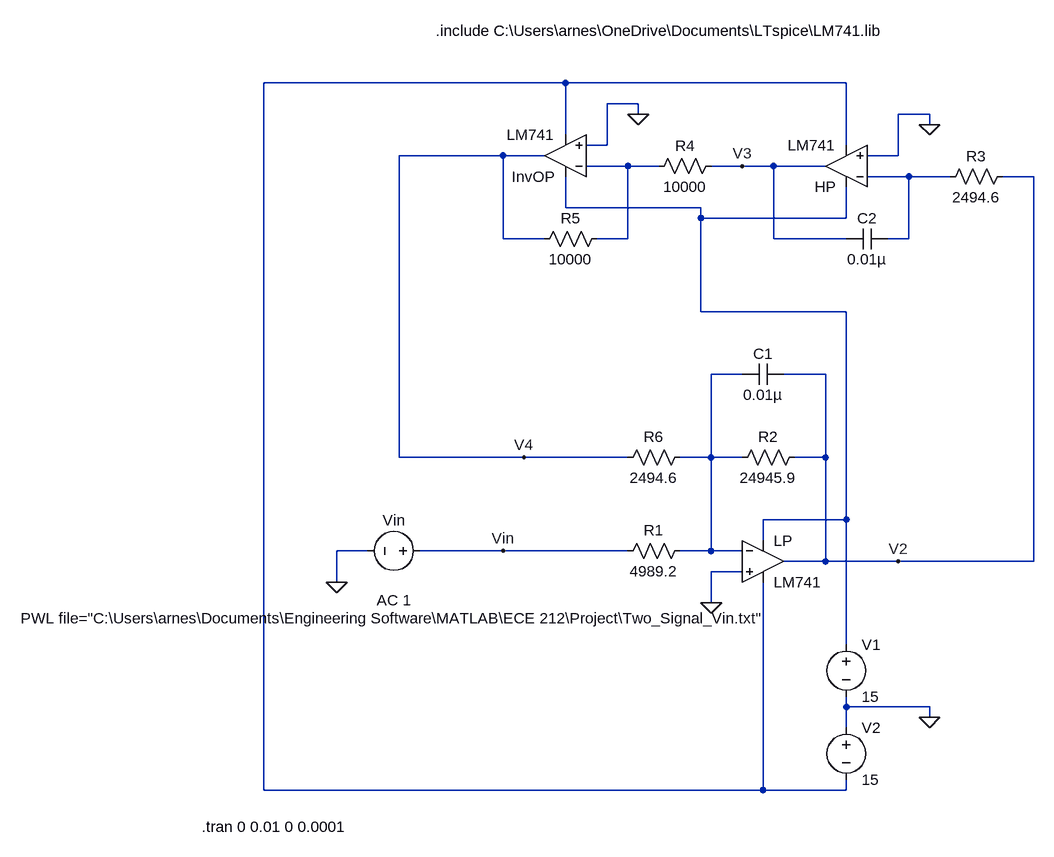
[diagram p0: schematic Band_6380Hz.asc]
Band_6380Hz.asc, the LTspice schematic file:
Version 4.1
SHEET 1 964 792
WIRE 240 -368 -224 -368
WIRE 672 -368 240 -368
WIRE 352 -336 304 -336
WIRE 352 -320 352 -336
WIRE 800 -320 752 -320
WIRE 800 -304 800 -320
WIRE 240 -288 240 -368
WIRE 304 -272 304 -336
WIRE 304 -272 272 -272
WIRE 672 -272 672 -368
WIRE 144 -256 -16 -256
WIRE 208 -256 144 -256
WIRE 752 -256 752 -320
WIRE 752 -256 704 -256
WIRE 336 -240 272 -240
WIRE 384 -240 336 -240
WIRE 512 -240 464 -240
WIRE 560 -240 512 -240
WIRE 640 -240 560 -240
WIRE 768 -224 704 -224
WIRE 832 -224 768 -224
WIRE 960 -224 912 -224
WIRE 240 -176 240 -224
WIRE 448 -176 240 -176
WIRE 448 -160 448 -176
WIRE 672 -160 672 -208
WIRE 672 -160 448 -160
WIRE 144 -128 144 -256
WIRE 208 -128 144 -128
WIRE 336 -128 336 -240
WIRE 336 -128 288 -128
WIRE 560 -128 560 -240
WIRE 672 -128 560 -128
WIRE 768 -128 768 -224
WIRE 768 -128 736 -128
WIRE 448 -16 448 -160
WIRE 672 -16 448 -16
WIRE 512 80 464 80
WIRE 640 80 576 80
WIRE -16 208 -16 -256
WIRE 176 208 -16 208
WIRE 336 208 176 208
WIRE 464 208 464 80
WIRE 464 208 416 208
WIRE 512 208 464 208
WIRE 640 208 640 80
WIRE 640 208 592 208
WIRE 672 304 672 -16
WIRE 672 304 544 304
WIRE 544 336 544 304
WIRE -64 352 -112 352
WIRE 144 352 16 352
WIRE 336 352 144 352
WIRE 464 352 464 208
WIRE 464 352 416 352
WIRE 512 352 464 352
WIRE 640 368 640 208
WIRE 640 368 576 368
WIRE 752 368 640 368
WIRE 960 368 960 -224
WIRE 960 368 752 368
WIRE 512 384 464 384
WIRE -112 400 -112 352
WIRE 464 432 464 384
WIRE 672 496 672 304
WIRE 672 592 672 576
WIRE 800 592 672 592
WIRE 800 608 800 592
WIRE 672 624 672 592
WIRE -224 720 -224 -368
WIRE 544 720 544 400
WIRE 544 720 -224 720
WIRE 672 720 672 704
WIRE 672 720 544 720
FLAG -112 400 0
FLAG 464 432 0
FLAG 800 -304 0
FLAG 352 -320 0
FLAG 176 208 V4
FLAG 144 352 Vin
FLAG 752 368 V2
FLAG 512 -240 V3
FLAG 800 608 0
SYMBOL voltage 32 352 R90
WINDOW 0 -32 56 VBottom 2
WINDOW 3 88 56 VTop 2
WINDOW 123 60 56 VTop 2
WINDOW 39 0 0 Left 0
SYMATTR InstName Vin
SYMATTR Value PWL file="C:\Users\arnes\Documents\Engineering Software\MATLAB\ECE 212\Project\Two_Signal_Vin.txt"
SYMATTR Value2 AC 1
SYMBOL res 432 336 R90
WINDOW 0 0 56 VBottom 2
WINDOW 3 32 56 VTop 2
SYMATTR InstName R1
SYMATTR Value 4989.2
SYMBOL res 432 192 R90
WINDOW 0 0 56 VBottom 2
WINDOW 3 32 56 VTop 2
SYMATTR InstName R6
SYMATTR Value 2494.6
SYMBOL cap 576 64 R90
WINDOW 0 0 32 VBottom 2
WINDOW 3 32 32 VTop 2
SYMATTR InstName C1
SYMATTR Value 0.01µ
SYMBOL res 608 192 R90
WINDOW 0 0 56 VBottom 2
WINDOW 3 32 56 VTop 2
SYMATTR InstName R2
SYMATTR Value 24945.9
SYMBOL res 928 -240 R90
WINDOW 0 0 56 VBottom 2
WINDOW 3 32 56 VTop 2
SYMATTR InstName R3
SYMATTR Value 2494.6
SYMBOL cap 736 -144 R90
WINDOW 0 0 32 VBottom 2
WINDOW 3 32 32 VTop 2
SYMATTR InstName C2
SYMATTR Value 0.01µ
SYMBOL res 480 -256 R90
WINDOW 0 0 56 VBottom 2
WINDOW 3 32 56 VTop 2
SYMATTR InstName R4
SYMATTR Value 10000
SYMBOL res 304 -144 R90
WINDOW 0 0 56 VBottom 2
WINDOW 3 32 56 VTop 2
SYMATTR InstName R5
SYMATTR Value 10000
SYMBOL OpAmps\\opamp2 544 304 R0
SYMATTR InstName LP
SYMATTR Value LM741
SYMBOL OpAmps\\opamp2 672 -176 R180
SYMATTR InstName HP
SYMATTR Value LM741
SYMBOL OpAmps\\opamp2 240 -192 R180
SYMATTR InstName InvOP
SYMATTR Value LM741
SYMBOL voltage 672 480 R0
SYMATTR InstName V1
SYMATTR Value 15
SYMBOL voltage 672 608 R0
SYMATTR InstName V2
SYMATTR Value 15
TEXT 40 -448 Left 2 !.include C:\\Users\\arnes\\OneDrive\\Documents\\LTspice\\LM741.lib
TEXT -320 776 Left 2 !.tran 0 0.01 0 0.0001

The netlist it stands for:
* Band_6380Hz.asc
Vin Vin 0 PWL file="C:\Users\arnes\Documents\Engineering Software\MATLAB\ECE 212\Project\Two_Signal_Vin.txt" AC 1
R1 N005 Vin 4989.2
R6 N005 V4 2494.6
C1 V2 N005 0.01µ
R2 V2 N005 24945.9
R3 V2 N003 2494.6
C2 N003 V3 0.01µ
R4 V3 N002 10000
R5 N002 V4 10000
X§LP 0 N005 N004 N001 V2 LM741  ; pins In+ In- V+ V- OUT
X§HP 0 N003 N004 N001 V3 LM741  ; pins In+ In- V+ V- OUT
X§InvOP 0 N002 N004 N001 V4 LM741  ; pins In+ In- V+ V- OUT
V1 N004 0 15
V2 0 N001 15
.include C:\Users\arnes\OneDrive\Documents\LTspice\LM741.lib
.tran 0 0.01 0 0.0001
.backanno
.end